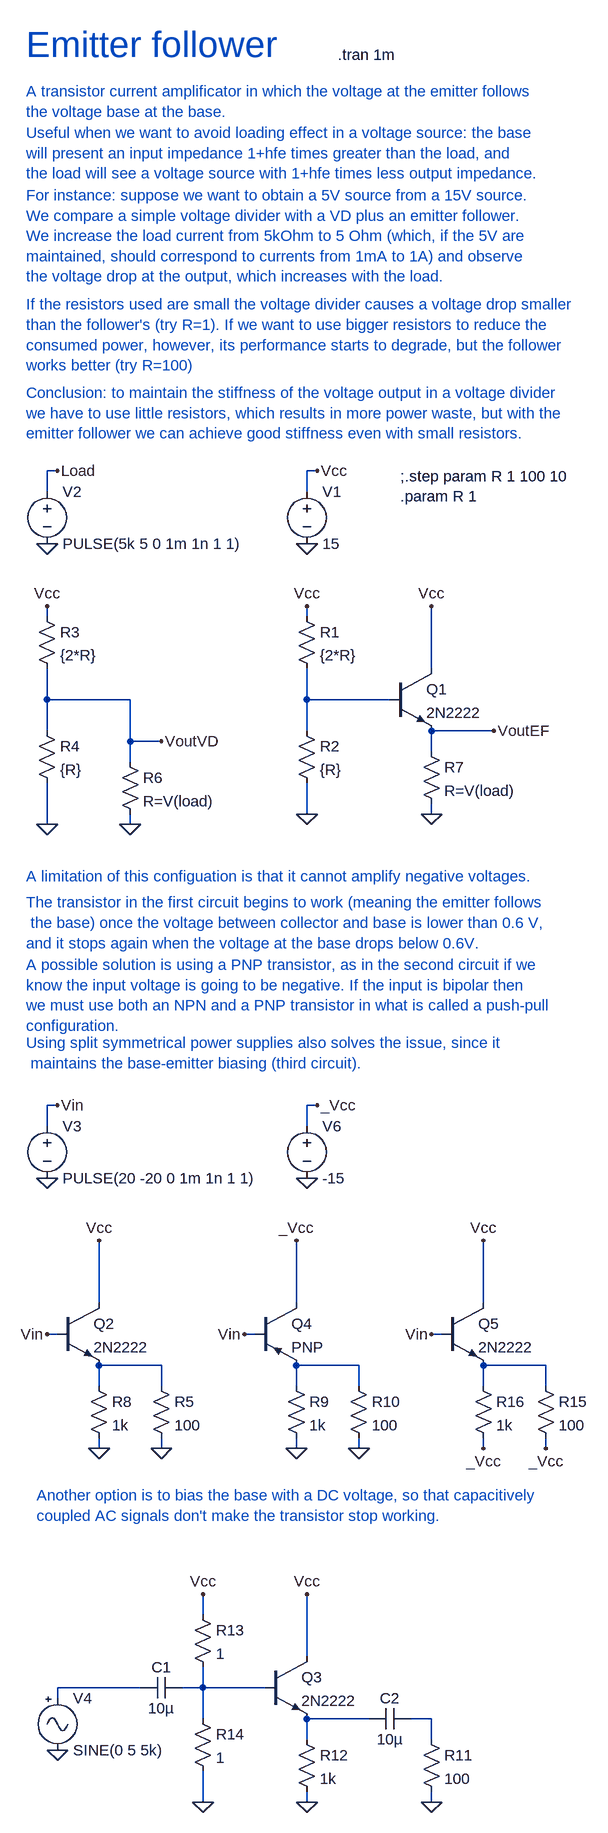
[diagram p0: schematic emitterfollower.asc]
emitterfollower.asc, the LTspice schematic file:
Version 4
SHEET 1 1452 2796
WIRE -448 304 -464 304
WIRE -48 304 -64 304
WIRE -464 336 -464 304
WIRE -64 336 -64 304
WIRE -464 528 -464 512
WIRE -64 528 -64 512
WIRE 128 608 128 512
WIRE -464 656 -464 608
WIRE -336 656 -464 656
WIRE -64 656 -64 608
WIRE 64 656 -64 656
WIRE -464 704 -464 656
WIRE -64 704 -64 656
WIRE 224 704 128 704
WIRE -336 720 -336 656
WIRE -288 720 -336 720
WIRE 128 736 128 704
WIRE -336 752 -336 720
WIRE -64 832 -64 784
WIRE 128 832 128 816
WIRE -464 848 -464 784
WIRE -336 848 -336 832
WIRE -448 1280 -464 1280
WIRE -48 1280 -64 1280
WIRE -464 1312 -464 1280
WIRE -64 1312 -64 1280
WIRE -384 1584 -384 1488
WIRE -80 1584 -80 1488
WIRE 208 1584 208 1488
WIRE -448 1632 -464 1632
WIRE -144 1632 -160 1632
WIRE 144 1632 128 1632
WIRE -288 1680 -384 1680
WIRE 16 1680 -80 1680
WIRE 304 1680 208 1680
WIRE -384 1712 -384 1680
WIRE -288 1712 -288 1680
WIRE -80 1712 -80 1680
WIRE 16 1712 16 1680
WIRE 208 1712 208 1680
WIRE 304 1712 304 1680
WIRE -384 1808 -384 1792
WIRE -288 1808 -288 1792
WIRE -80 1808 -80 1792
WIRE 16 1808 16 1792
WIRE 208 1808 208 1792
WIRE 304 1808 304 1792
WIRE -224 2064 -224 2032
WIRE -64 2128 -64 2032
WIRE -320 2176 -448 2176
WIRE -224 2176 -224 2144
WIRE -224 2176 -256 2176
WIRE -128 2176 -224 2176
WIRE -448 2192 -448 2176
WIRE -224 2224 -224 2176
WIRE 32 2224 -64 2224
WIRE 128 2224 96 2224
WIRE -64 2256 -64 2224
WIRE 128 2256 128 2224
WIRE -224 2352 -224 2304
WIRE -64 2352 -64 2336
WIRE 128 2352 128 2336
FLAG -64 416 0
FLAG -64 832 0
FLAG 128 832 0
FLAG 224 704 VoutEF
FLAG -464 848 0
FLAG -336 848 0
FLAG -288 720 VoutVD
FLAG -48 304 Vcc
FLAG 128 512 Vcc
FLAG -64 512 Vcc
FLAG -464 512 Vcc
FLAG -464 416 0
FLAG -448 304 Load
FLAG -384 1808 0
FLAG -384 1488 Vcc
FLAG -288 1808 0
FLAG -80 1808 0
FLAG 16 1808 0
FLAG -64 1392 0
FLAG -48 1280 _Vcc
FLAG -80 1488 _Vcc
FLAG -448 1280 Vin
FLAG -464 1392 0
FLAG -464 1632 Vin
FLAG -160 1632 Vin
FLAG -64 2352 0
FLAG -64 2032 Vcc
FLAG 128 2352 0
FLAG -448 2272 0
FLAG -224 2032 Vcc
FLAG -224 2352 0
FLAG 208 1488 Vcc
FLAG 128 1632 Vin
FLAG 208 1808 _Vcc
FLAG 304 1808 _Vcc
SYMBOL npn 64 608 R0
SYMATTR InstName Q1
SYMATTR Value 2N2222
SYMBOL res -80 512 R0
SYMATTR InstName R1
SYMATTR Value {2*R}
SYMBOL res -80 688 R0
SYMATTR InstName R2
SYMATTR Value {R}
SYMBOL res -480 512 R0
SYMATTR InstName R3
SYMATTR Value {2*R}
SYMBOL res -480 688 R0
SYMATTR InstName R4
SYMATTR Value {R}
SYMBOL voltage -64 320 R0
WINDOW 123 0 0 Left 0
WINDOW 39 0 0 Left 0
SYMATTR InstName V1
SYMATTR Value 15
SYMBOL voltage -464 320 R0
WINDOW 123 0 0 Left 0
WINDOW 39 0 0 Left 0
SYMATTR InstName V2
SYMATTR Value PULSE(5k 5 0 1m 1n 1 1)
SYMBOL voltage -464 1296 R0
WINDOW 123 0 0 Left 0
WINDOW 39 0 0 Left 0
SYMATTR InstName V3
SYMATTR Value PULSE(20 -20 0 1m 1n 1 1)
SYMBOL npn -448 1584 R0
SYMATTR InstName Q2
SYMATTR Value 2N2222
SYMBOL res -352 736 R0
SYMATTR InstName R6
SYMATTR Value R=V(load)
SYMBOL res 112 720 R0
SYMATTR InstName R7
SYMATTR Value R=V(load)
SYMBOL res -96 1696 R0
SYMATTR InstName R9
SYMATTR Value 1k
SYMBOL res 0 1696 R0
SYMATTR InstName R10
SYMATTR Value 100
SYMBOL res -304 1696 R0
SYMATTR InstName R5
SYMATTR Value 100
SYMBOL res -400 1696 R0
SYMATTR InstName R8
SYMATTR Value 1k
SYMBOL pnp -144 1584 R0
SYMATTR InstName Q4
SYMBOL voltage -64 1296 R0
WINDOW 123 0 0 Left 0
WINDOW 39 0 0 Left 0
SYMATTR InstName V6
SYMATTR Value -15
SYMBOL npn -128 2128 R0
SYMATTR InstName Q3
SYMATTR Value 2N2222
SYMBOL res 112 2240 R0
SYMATTR InstName R11
SYMATTR Value 100
SYMBOL res -80 2240 R0
SYMATTR InstName R12
SYMATTR Value 1k
SYMBOL Misc\\signal -448 2176 R0
WINDOW 123 0 0 Left 0
WINDOW 39 0 0 Left 0
SYMATTR InstName V4
SYMATTR Value SINE(0 5 5k)
SYMBOL res -240 2048 R0
SYMATTR InstName R13
SYMATTR Value 1
SYMBOL res -240 2208 R0
SYMATTR InstName R14
SYMATTR Value 1
SYMBOL cap -256 2160 R90
WINDOW 0 0 32 VBottom 2
WINDOW 3 32 32 VTop 2
SYMATTR InstName C1
SYMATTR Value 10µ
SYMBOL cap 96 2208 R90
WINDOW 0 0 32 VBottom 2
WINDOW 3 32 32 VTop 2
SYMATTR InstName C2
SYMATTR Value 10µ
SYMBOL npn 144 1584 R0
SYMATTR InstName Q5
SYMATTR Value 2N2222
SYMBOL res 288 1696 R0
SYMATTR InstName R15
SYMATTR Value 100
SYMBOL res 192 1696 R0
SYMATTR InstName R16
SYMATTR Value 1k
TEXT -16 -336 Left 2 !.tran 1m
TEXT 80 312 Left 2 !;.step param R 1 100 10\n.param R 1
TEXT -496 -352 Left 5 ;Emitter follower
TEXT -496 -280 Left 2 ;A transistor current amplificator in which the voltage at the emitter follows \nthe voltage base at the base.
TEXT -496 -216 Left 2 ;Useful when we want to avoid loading effect in a voltage source: the base\nwill present an input impedance 1+hfe times greater than the load, and \nthe load will see a voltage source with 1+hfe times less output impedance.
TEXT -496 -120 Left 2 ;For instance: suppose we want to obtain a 5V source from a 15V source.\nWe compare a simple voltage divider with a VD plus an emitter follower.\nWe increase the load current from 5kOhm to 5 Ohm (which, if the 5V are\nmaintained, should correspond to currents from 1mA to 1A) and observe \nthe voltage drop at the output, which increases with the load.
TEXT -496 48 Left 2 ;If the resistors used are small the voltage divider causes a voltage drop smaller \nthan the follower's (try R=1). If we want to use bigger resistors to reduce the \nconsumed power, however, its performance starts to degrade, but the follower\nworks better (try R=100)
TEXT -496 928 Left 2 ;A limitation of this configuation is that it cannot amplify negative voltages.
TEXT -496 184 Left 2 ;Conclusion: to maintain the stiffness of the voltage output in a voltage divider\nwe have to use little resistors, which results in more power waste, but with the\nemitter follower we can achieve good stiffness even with small resistors.
TEXT -496 968 Left 2 ;The transistor in the first circuit begins to work (meaning the emitter follows\n the base) once the voltage between collector and base is lower than 0.6 V, \nand it stops again when the voltage at the base drops below 0.6V.
TEXT -496 1064 Left 2 ;A possible solution is using a PNP transistor, as in the second circuit if we \nknow the input voltage is going to be negative. If the input is bipolar then \nwe must use both an NPN and a PNP transistor in what is called a push-pull \nconfiguration.
TEXT -480 1880 Left 2 ;Another option is to bias the base with a DC voltage, so that capacitively\ncoupled AC signals don't make the transistor stop working.
TEXT -496 1184 Left 2 ;Using split symmetrical power supplies also solves the issue, since it\n maintains the base-emitter biasing (third circuit).

The netlist it stands for:
* emitterfollower.asc
Q1 Vcc N001 VoutEF 0 2N2222
R1 Vcc N001 {2*R}
R2 N001 0 {R}
R3 Vcc VoutVD {2*R}
R4 VoutVD 0 {R}
V1 Vcc 0 15
V2 Load 0 PULSE(5k 5 0 1m 1n 1 1)
V3 Vin 0 PULSE(20 -20 0 1m 1n 1 1)
Q2 Vcc Vin N002 0 2N2222
R6 VoutVD 0 R=V(load)
R7 VoutEF 0 R=V(load)
R9 N003 0 1k
R10 N003 0 100
R5 N002 0 100
R8 N002 0 1k
Q4 _Vcc Vin N003 0 PNP
V6 _Vcc 0 -15
Q3 Vcc N006 N007 0 2N2222
R11 N008 0 100
R12 N007 0 1k
V4 N005 0 SINE(0 5 5k)
R13 Vcc N006 1
R14 N006 0 1
C1 N006 N005 10µ
C2 N008 N007 10µ
Q5 Vcc Vin N004 0 2N2222
R15 N004 _Vcc 100
R16 N004 _Vcc 1k
.model NPN NPN
.model PNP PNP
.lib standard.bjt
.tran 1m
;.step param R 1 100 10
.param R 1
* Emitter follower
* A transistor current amplificator in which the voltage at the emitter follows
* the voltage base at the base.
* Useful when we want to avoid loading effect in a voltage source: the base
* will present an input impedance 1+hfe times greater than the load, and
* the load will see a voltage source with 1+hfe times less output impedance.
* For instance: suppose we want to obtain a 5V source from a 15V source.
* We compare a simple voltage divider with a VD plus an emitter follower.
* We increase the load current from 5kOhm to 5 Ohm (which, if the 5V are
* maintained, should correspond to currents from 1mA to 1A) and observe
* the voltage drop at the output, which increases with the load.
* If the resistors used are small the voltage divider causes a voltage drop smaller
* than the follower's (try R=1). If we want to use bigger resistors to reduce the
* consumed power, however, its performance starts to degrade, but the follower
* works better (try R=100)
* A limitation of this configuation is that it cannot amplify negative voltages.
* Conclusion: to maintain the stiffness of the voltage output in a voltage divider
* we have to use little resistors, which results in more power waste, but with the
* emitter follower we can achieve good stiffness even with small resistors.
* The transistor in the first circuit begins to work (meaning the emitter follows
*  the base) once the voltage between collector and base is lower than 0.6 V,
* and it stops again when the voltage at the base drops below 0.6V.
* A possible solution is using a PNP transistor, as in the second circuit if we
* know the input voltage is going to be negative. If the input is bipolar then
* we must use both an NPN and a PNP transistor in what is called a push-pull
* configuration.
* Another option is to bias the base with a DC voltage, so that capacitively
* coupled AC signals don't make the transistor stop working.
* Using split symmetrical power supplies also solves the issue, since it
*  maintains the base-emitter biasing (third circuit).
.backanno
.end